# Altium schematic sheet Main_Sheet.SchDoc
size A3; Organization: ETML-ES; Address1: Avenue Recordon 1; Address2: 1004 Lausanne; Address3: Switzerland; SheetNumber: 1; SheetTotal: 4
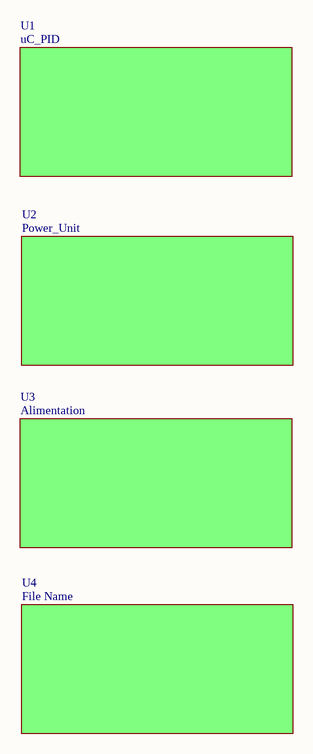
[diagram p0: Main_Sheet.SchDoc]

## Sub-sheets
U1 = uC_PID: no entries
U2 = Power_Unit: no entries
U3 = Alimentation: no entries
U4 = File Name: no entries

## Notes on the sheet
- Fichier :
- a
- Date :
- Heure :
- Version :
- Auteur :
- Modif.
- b
- c
- d
- Projet :
- No :
- Nb feuilles
- Feuille n°
- Chemin :